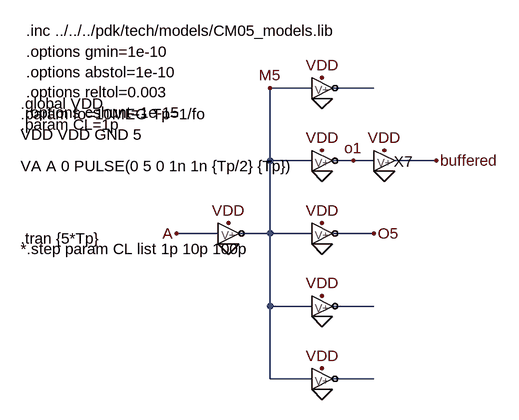
[diagram p0: schematic NOT_CHAIN.asc]
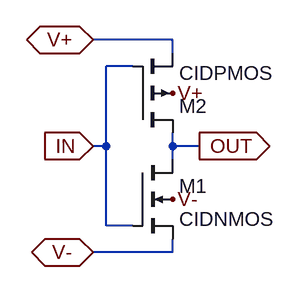
[diagram p1: sub-circuit not.asc]
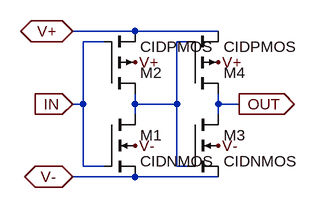
[diagram p2: sub-circuit buffer.asc]
NOT_CHAIN.asc, the LTspice schematic file:
Version 4.1
SHEET 1 1676 948
WIRE 288 -16 224 -16
WIRE 384 -16 320 -16
WIRE 224 96 224 -16
WIRE 288 96 224 96
WIRE 352 96 320 96
WIRE 384 96 352 96
WIRE 480 96 416 96
WIRE 144 208 80 208
WIRE 224 208 224 96
WIRE 224 208 176 208
WIRE 288 208 224 208
WIRE 384 208 320 208
WIRE 224 320 224 208
WIRE 288 320 224 320
WIRE 384 320 320 320
WIRE 224 432 224 320
WIRE 288 432 224 432
WIRE 384 432 320 432
FLAG 80 208 A
FLAG 224 -16 M5
FLAG 384 208 O5
FLAG 304 -32 VDD
FLAG 304 80 VDD
FLAG 304 192 VDD
FLAG 304 304 VDD
FLAG 304 416 VDD
FLAG 304 0 0
FLAG 304 112 0
FLAG 304 224 0
FLAG 304 336 0
FLAG 304 448 0
FLAG 160 224 0
FLAG 160 192 VDD
FLAG 400 80 VDD
FLAG 400 112 0
FLAG 480 96 buffered
FLAG 352 96 o1
SYMBOL NOT 144 208 R0
WINDOW 0 92 -39 Invisible 2
SYMATTR InstName X1
SYMBOL NOT 288 -16 R0
WINDOW 0 92 -39 Invisible 2
SYMATTR InstName X2
SYMBOL NOT 288 96 R0
WINDOW 0 92 -39 Invisible 2
SYMATTR InstName X3
SYMBOL NOT 288 208 R0
WINDOW 0 92 -39 Invisible 2
SYMATTR InstName X4
SYMBOL NOT 288 320 R0
WINDOW 0 92 -39 Invisible 2
SYMATTR InstName X5
SYMBOL NOT 288 432 R0
WINDOW 0 92 -39 Invisible 2
SYMATTR InstName X6
SYMBOL Buffer 400 96 R0
SYMATTR InstName X7
TEXT -152 -104 Left 2 !.inc ../../../pdk/tech/models/CM05_models.lib
TEXT -160 104 Left 2 !VA A 0 PULSE(0 5 0 1n 1n {Tp/2} {Tp})
TEXT -160 216 Left 2 !.tran {5*Tp}
TEXT -160 8 Left 2 !.global VDD
TEXT -160 40 Left 2 !.param CL=1p
TEXT -160 232 Left 2 !*.step param CL list 1p 10p 100p
TEXT -160 24 Left 2 !.param fo=10MEG Tp=1/fo
TEXT -152 -72 Left 2 !.options gmin=1e-10\n.options abstol=1e-10\n.options reltol=0.003\n.options cshunt=1e-15
TEXT -160 56 Left 2 !VDD VDD GND 5

not.asc, the sub-circuit schematic file:
Version 4.1
SHEET 1 880 680
WIRE 256 16 160 16
WIRE 256 32 256 16
WIRE 208 48 176 48
WIRE 176 144 176 48
WIRE 176 144 160 144
WIRE 256 144 256 128
WIRE 288 144 256 144
WIRE 256 160 256 144
WIRE 176 240 176 144
WIRE 208 240 176 240
WIRE 256 272 256 256
WIRE 256 272 160 272
FLAG 160 144 IN
IOPIN 160 144 In
FLAG 288 144 OUT
IOPIN 288 144 Out
FLAG 160 272 V-
IOPIN 160 272 BiDir
FLAG 256 208 V-
FLAG 160 16 V+
IOPIN 160 16 BiDir
FLAG 256 80 V+
SYMBOL nmos4 208 160 R0
SYMATTR InstName M1
SYMATTR Value CIDNMOS
SYMATTR Value2 l=5u w=10u
SYMBOL pmos4 208 128 M180
SYMATTR InstName M2
SYMATTR Value CIDPMOS
SYMATTR Value2 l=5u w=25u

buffer.asc, the sub-circuit schematic file:
Version 4.1
SHEET 1 880 680
WIRE 256 32 160 32
WIRE 384 32 256 32
WIRE 208 48 176 48
WIRE 336 48 320 48
WIRE 176 144 176 48
WIRE 176 144 160 144
WIRE 256 144 256 128
WIRE 320 144 320 48
WIRE 320 144 256 144
WIRE 384 144 384 128
WIRE 416 144 384 144
WIRE 256 160 256 144
WIRE 384 160 384 144
WIRE 176 240 176 144
WIRE 208 240 176 240
WIRE 320 240 320 144
WIRE 336 240 320 240
WIRE 256 256 160 256
WIRE 384 256 256 256
FLAG 160 144 IN
IOPIN 160 144 In
FLAG 416 144 OUT
IOPIN 416 144 Out
FLAG 160 256 V-
IOPIN 160 256 BiDir
FLAG 256 208 V-
FLAG 160 32 V+
IOPIN 160 32 BiDir
FLAG 256 80 V+
FLAG 384 208 V-
FLAG 384 80 V+
SYMBOL nmos4 208 160 R0
SYMATTR InstName M1
SYMATTR Value CIDNMOS
SYMATTR Value2 l=5u w=10u
SYMBOL pmos4 208 128 M180
SYMATTR InstName M2
SYMATTR Value CIDPMOS
SYMATTR Value2 l=5u w=25u
SYMBOL nmos4 336 160 R0
SYMATTR InstName M3
SYMATTR Value CIDNMOS
SYMATTR Value2 l=5u w=10u
SYMBOL pmos4 336 128 M180
SYMATTR InstName M4
SYMATTR Value CIDPMOS
SYMATTR Value2 l=5u w=25u

The netlist it stands for:
* NOT_CHAIN.asc
X§X1 A M5 VDD 0 not
X§X2 M5 N001 VDD 0 not
X§X3 M5 o1 VDD 0 not
X§X4 M5 O5 VDD 0 not
X§X5 M5 N002 VDD 0 not
X§X6 M5 N003 VDD 0 not
X§X7 o1 buffered VDD 0 buffer

* block symbol definitions
.subckt not IN OUT V+ V-
M1 OUT IN V- V- CIDNMOS l=5u w=10u
M2 OUT IN V+ V+ CIDPMOS l=5u w=25u
.ends not

.subckt buffer IN OUT V+ V-
M1 N001 IN V- V- CIDNMOS l=5u w=10u
M2 N001 IN V+ V+ CIDPMOS l=5u w=25u
M3 OUT N001 V- V- CIDNMOS l=5u w=10u
M4 OUT N001 V+ V+ CIDPMOS l=5u w=25u
.ends buffer

.model NMOS NMOS
.model PMOS PMOS
.lib standard.mos
.inc ../../../pdk/tech/models/CM05_models.lib
VA A 0 PULSE(0 5 0 1n 1n {Tp/2} {Tp})
.tran {5*Tp}
.global VDD
.param CL=1p
*.step param CL list 1p 10p 100p
.param fo=10MEG Tp=1/fo
.options gmin=1e-10
.options abstol=1e-10
.options reltol=0.003
.options cshunt=1e-15
VDD VDD GND 5
.backanno
.end